# Altium schematic sheet breakout_board.SchDoc
size B
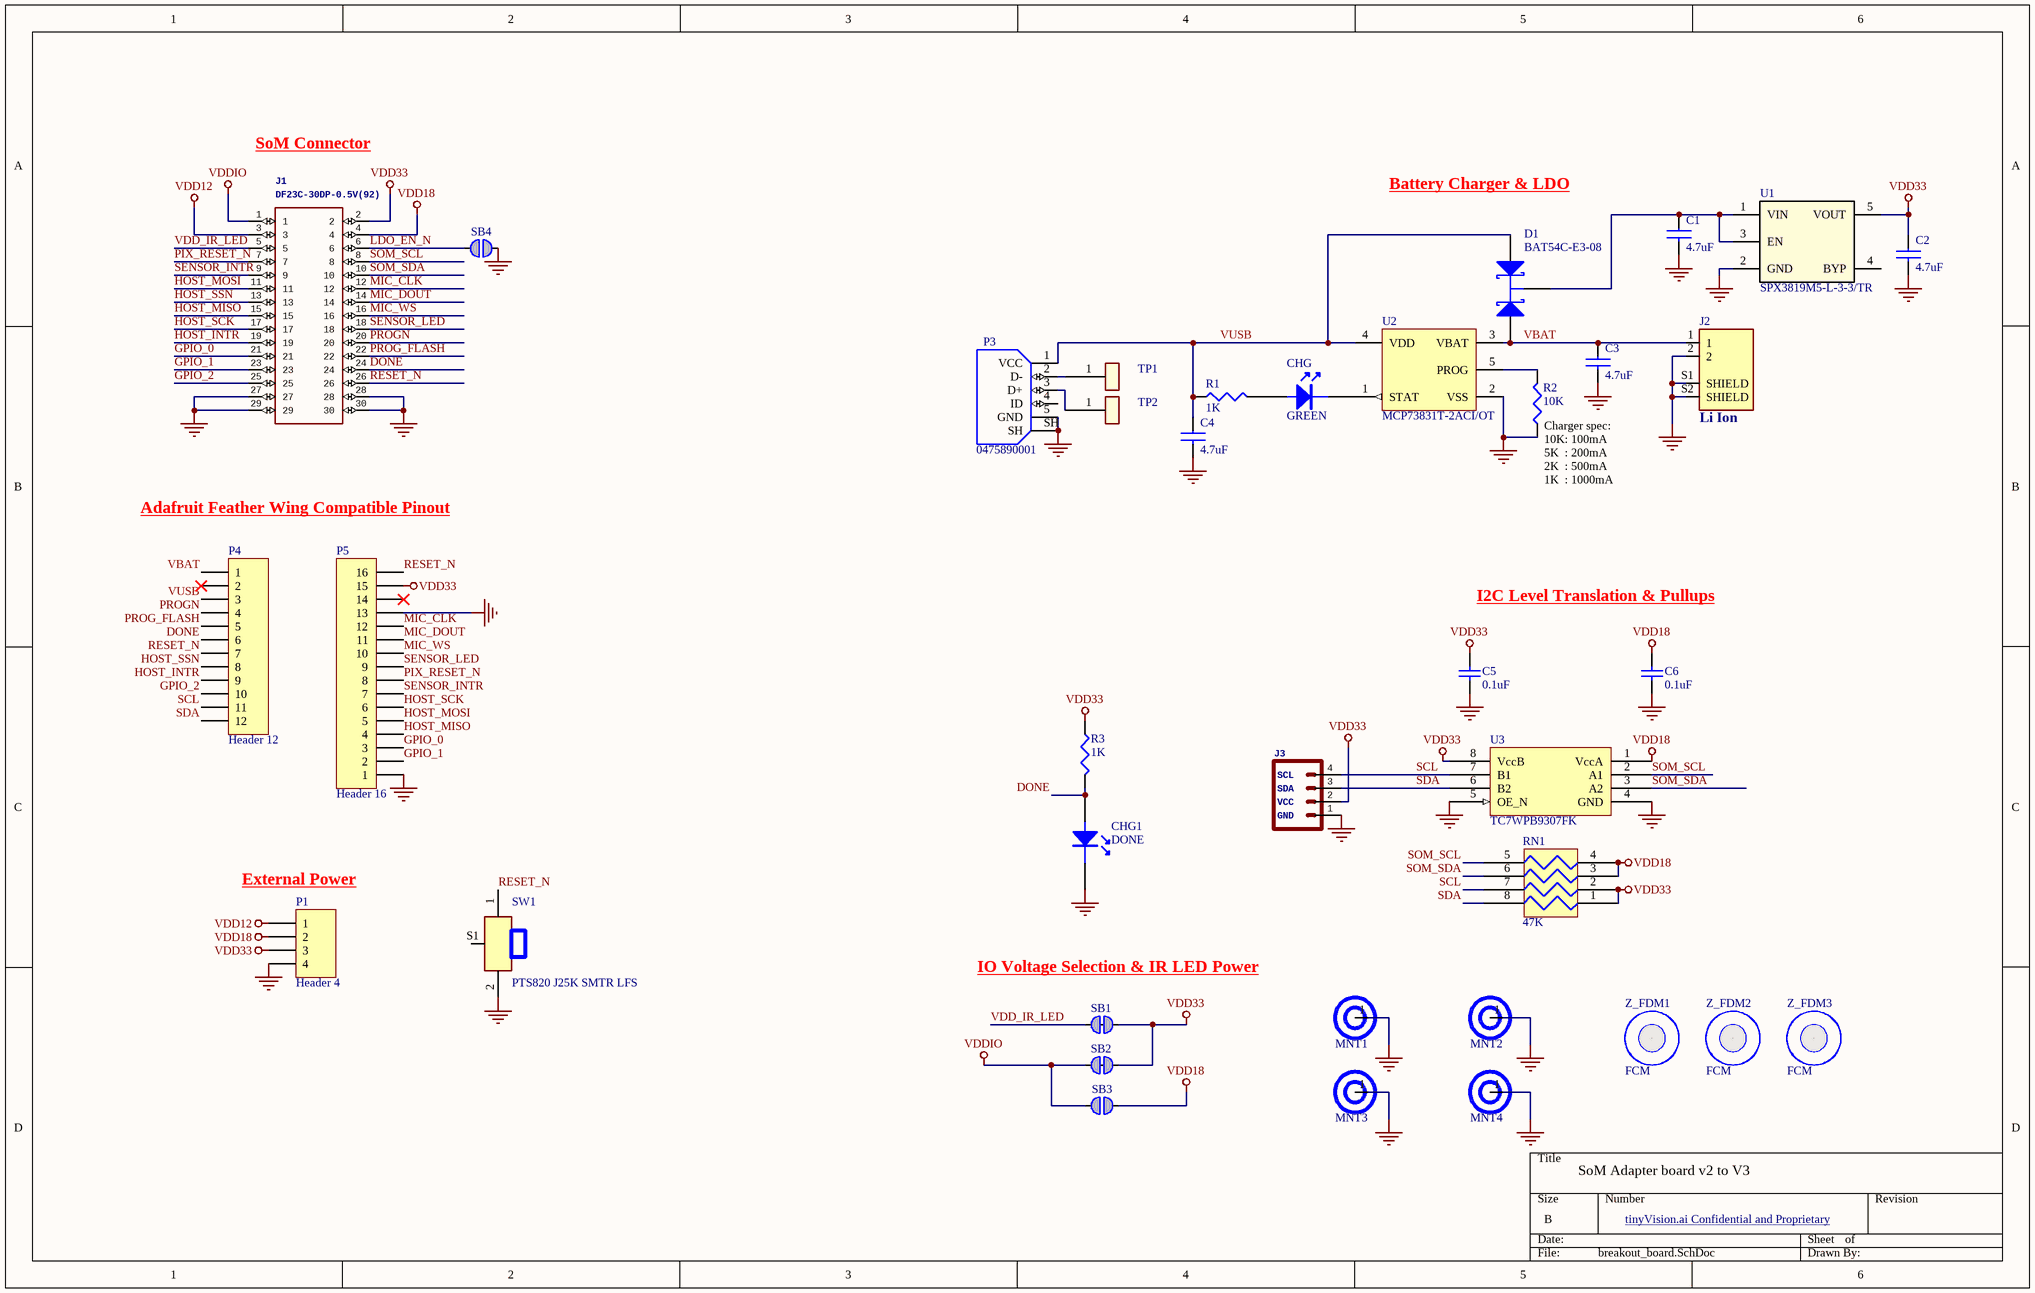
[diagram p0: breakout_board.SchDoc]

## Parts
C1  4.7uF  [CAPC1005X61USR]
C2  4.7uF  [CAPC1005X61USR]
C3  4.7uF  [CAPC1005X61USR]
C4  4.7uF  [CAPC1005X61USR]
C5  0.1uF  [CAPC1005X61USR]
C6  0.1uF  [CAPC1005X61USR]
CHG  GREEN  [LED_0805]
CHG1  DONE  [LED_0805]
D1  BAT54C-E3-08  [SOT-23]
J1  DF23C-30DP-0.5V(92)  [SOM-SMD]
J2  Li Ion  [JST_S2B-PH-SM4-TB(LF)(SN)]
J3  (no value)  [1X04_1MM_RA]
MNT1  MOUNTING HOLE  [MNT620-275N]  (value not drawn)
MNT2  MOUNTING HOLE  [MNT620-275N]  (value not drawn)
MNT3  MOUNTING HOLE  [MNT620-275N]  (value not drawn)
MNT4  MOUNTING HOLE  [MNT620-275N]  (value not drawn)
P1  Header 4  [HDR1X4]
P3  0475890001  [*MOLEX_0475890001]
P4  Header 12  [HDR1X12]
P5  Header 16  [HDR1X16]
R1  1K  [RESC1005X40USR]
R2  10K  [RESC1005X40USR]
R3  1K  [RESC1005X40USR]
RN1  47K  [RESCAXS50P100X200X45-8NA]
SB1  Solderbridge  [Solderbridge_Shorted]  (value not drawn)  (net tie, no BOM)
SB2  Solderbridge  [Solderbridge_Shorted]  (value not drawn)  (net tie, no BOM)
SB3  Solderbridge  [Solderbridge]  (value not drawn)  (no BOM)
SB4  Solderbridge  [Solderbridge]  (value not drawn)  (no BOM)
SW1  PTS820 J25K SMTR LFS  [PTS820J25MSMTRLFS]
TP1  TEST POINT  [TP 1mm]  (value not drawn)
TP2  TEST POINT  [TP 1mm]  (value not drawn)
U1  SPX3819M5-L-3-3/TR  [SOT-23-5]
U2  MCP73831T-2ACI/OT  [SOT-23-5]
U3  TC7WPB9307FK  [8-VFSOP]
Z_FDM1  FCM  [FID100X250N]
Z_FDM2  FCM  [FID100X250N]
Z_FDM3  FCM  [FID100X250N]

## Nets
GND: C1.2 C2.2 C3.2 C4.2 C5.2 C6.2 CHG1.2 J1.27 J1.28 J1.29 J1.30 J2.2 J2.S1(SHIELD) J2.S2(SHIELD) J3.1 MNT1.1(GND) MNT2.1(GND) MNT3.1(GND) MNT4.1(GND) P1.4 P3.5(GND) P3.SH P5.1 P5.13 R2.1 SB4.1 SW1.2 U1.2(GND) U2.2(VSS) U3.4(GND) U3.5(OE_N)
VDD12: J1.3 P1.1
VDD18: C6.1 J1.4 P1.2 RN1.3 RN1.4 SB3.1 U3.1(VccA)
VDD33: C2.1 C5.1 J1.2 J3.2 P1.3 P5.15 R3.1 RN1.1 RN1.2 SB1.1 SB2.1 U1.5(VOUT) U3.8(VccB)
VDDIO: J1.1 SB2.2 SB3.2
DONE: CHG1.1 J1.24 P4.6 R3.2
GPIO_0: J1.21 P5.3
GPIO_1: J1.23 P5.2
GPIO_2: J1.25 P4.10
HOST_INTR: J1.19 P4.9
HOST_MISO: J1.15 P5.4
HOST_MOSI: J1.11 P5.5
HOST_SCK: J1.17 P5.6
HOST_SSN: J1.13 P4.8
LDO_EN_N: J1.6 SB4.2
MIC_CLK: J1.12 P5.12
MIC_DOUT: J1.14 P5.11
MIC_WS: J1.16 P5.10
PIX_RESET_N: J1.7 P5.8
PROG_FLASH: J1.22 P4.5
PROGN: J1.20 P4.4
RESET_N: J1.26 P4.7 P5.16 SW1.1
SCL: J3.4 P4.11 RN1.7 U3.7(B1)
SDA: J3.3 P4.12 RN1.8 U3.6(B2)
SENSOR_INTR: J1.9 P5.7
SENSOR_LED: J1.18 P5.9
SOM_SCL: J1.8 RN1.5 U3.2(A1)
SOM_SDA: J1.10 RN1.6 U3.3(A2)
VBAT: C3.1 D1.1(A) J2.1 P4.1 U2.3(VBAT)
VDD_IR_LED: J1.5 SB1.2
VUSB: C4.1 D1.2(A) P3.1(VCC) P4.3 R1.1 U2.4(VDD)
NetC1_1: C1.1 D1.3(K) U1.1(VIN) U1.3(EN)
NetCHG_1: CHG.1 R1.2
NetCHG_2: CHG.2 U2.1(STAT)
NetP3_2: P3.2(D-) TP1.1
NetP3_3: P3.3(D+) TP2.1
NetR2_2: R2.2 U2.5(PROG)

Not connected (* = marked no-connect by the designer): P3 4(ID); P4 2*; P5 14*; SW1 S1(GND); U1 4(BYP); Z_FDM1 1; Z_FDM2 1; Z_FDM3 1

## Notes on the sheet
- SoM Connector
- Battery Charger & LDO
- Adafruit Feather Wing Compatible Pinout
- (near R2) Charger spec:
  10K: 100mA
  5K  : 200mA
  2K  : 500mA
  1K  : 1000mA
- I2C Level Translation & Pullups
- (near P1) External Power
- (near SB1) IO Voltage Selection & IR LED Power
- SoM Adapter board v2 to V3
- tinyVision.ai Confidential and Proprietary <http://tinyVision.ai Confidential and Proprietary>

## Library data of the parts
C1-C4 = CAP NP: CAP CER 4.7UF 6.3V 0402; MPN: C0402C475M7PACTU; Mfg: KEMET; Supplier PN: 399-5499-1-ND
C5 C6 = Cap_100nF_X7R_10%_0402: CAP CER 0.1UF 6.3V 0402; Manufacturer: TDK; Part #: E-CAP-003; MPN: C0402C104Z4VAC7867; Mfg: KEMET; Supplier PN: 399-1043-1-ND; Package: 0402
CHG CHG1 = LED_1: Avago HSMG-C170; Mfg: Avago Technologies US Inc.; MPN: HSMG-C170; Supplier PN: 516-1434-1-ND
D1 = BAT54C: DIODE ARRAY SCHOTTKY 30V SOT23; Manufacturer: Rectron; Packing: Tape and Reel; IR (uA): 2; VF (mV): 800; Trr (ns): 5; Cd (pF): 10; VR (V): 30; Rth(j-a) (K/W): 500; RoHS: TRUE; ComponentLink2URL: http://www.nxp.com/documents/data_sheet/BAT54_SER.pdf; Manufacturer Part Number: BAT54C-E3-08; ComponentLink2Description: Datasheet; Temperature Range: -55 to 150 degC; PackageReference: SOT23-3; PackageDescription: 3-Pin Plastic Surface-mounted Package, Body 1.3 x 2.9 mm, Pitch 0.95 mm; Mounting Technology: Surface Mount; ComponentLink1URL: http://www.nxp.com/; DatasheetVersion: Rev. 5; ComponentLink1Description: Manufacturer URL; Supplier Part Number 1: BAT54C-E3-08CT-ND; Supplier 1: Digi-Key
J1 = DF23C-30DP-0.5V(92): CONN PLUG 30POS SMD GOLD; Manufacturer: Hirose Electric Co Ltd; Allied_Number: R1050738; Digi-Key Part Number: H11880CT-ND; SymbolName_1: DF23C-30DP-0.5V(92); LibraryName: DF23C-30DP-0.5V(92); DeviceSetName: DF23C-30DP-0.5V(92); Package: DF23C30DP05V92; Manufacturer Part Number: DF23C-30DP-0.5V(92); Mouser_Part_Number: 798-DF23C30DP05V92; Mouser_Price-Stock: https://www.mouser.com/Search/Refine.aspx?Keyword=798-DF23C30DP05V92; RS_Part_Number: 7241056; RS_Price-Stock: https://uk.rs-online.com/web/p/products/7241056; Allied_Price-Stock: https://www.alliedelec.com/hirose-electric-df23c-30dp-0-5v-92-/R1050738/; Height: 1mm
J2 = S2B-PH-SM4-TB(LF)(SN): CONN HEADER SMD R/A 2POS 2MM; Manufacturer: JST Sales; Pitch: 2.00mm; Manufacturer Part Number: S2B-PH-SM4-TB(LF)(SN); Supplier Part Number 1: 455-1749-1-ND; Package: None; Height: 5.51mm
J3 = QWIIC_CONNECTORJS-1MM: CONN HEADER SMD R/A 4POS 1MM; MPN: SM04B-SRSS-TB(LF)(SN); Mfg: JST Sales America Inc.; SDA: SDA; VCC: VCC; GND: GND; SCL: SCL; Supplier PN: 455-1804-1-ND
MNT1-MNT4 = MNT_1: Part #: NA; Notes: PCB; Emcraft #: NA
P1 = Header 4: Header, 4-Pin; LatestRevisionDate: 17-Jul-2002; LatestRevisionNote: Re-released for DXP Platform.; Publisher: Altium Limited
P3 = 0475890001: CONN RCPT MICRO USB AB 5P SMD RA; Mfg: Molex; MPN: 0475890001; Supplier PN: WM17143CT-ND
P4 = Header 12: Header, 12-Pin; LatestRevisionDate: 17-Jul-2002; LatestRevisionNote: Re-released for DXP Platform.; Publisher: Altium Limited
P5 = Header 16: Header, 16-Pin; LatestRevisionDate: 17-Jul-2002; LatestRevisionNote: Re-released for DXP Platform.; Publisher: Altium Limited
R1 R3 = R_SH: RESISTOR 1K OHM 1% 0.0625W 0402; MPN: RC0402FR-071KL; Mfg: Yageo; Supplier PN: 311-1.00KLRCT-ND
R2 = R_SH: RES SMD 10K OHM 1% 1/16W 0402; MPN: RC0402FR-0710KL; Mfg: Yageo; Supplier PN: 311-10.0KLRCT-ND
RN1 = EXB-N8V473JX: RES ARRAY 4 RES 47K OHM 0804; Manufacturer: Panasonic; Supplier Part Number 1: Y10473CT-ND; Manufacturer Part Number: EXB-N8V473JX; Price 100: $0.0363; value: 47K; Package: 0804; Price: $0.11; Height: 0.55mm; Supplier 1: Digi-Key
SB1 SB2 = Solderbridge Shorted: Shorted Solderbridge; Artikkelnr Noca: N.A.; Part Number: Solderbridge Shorted; Manufacturer: *; Manufacturer Part Number: *; Datasheet: *; LatestRevisionDate: 2012-08-07; Pin Count: 2; Publisher: Nordic Semiconductor; Published: 2012-08-07; Value: Solderbridge; Note: *; Supplier: *; Supplier part number: *; 2nd source Supplier: *; 2nd source part number: *; Footprint Doc: Solderbridge_Shorted; Artikkelnr Simpro: N.A.
SB3 SB4 = Solderbridge: Artikkelnr Noca: N.A.; Part Number: Solderbridge; Manufacturer: *; Manufacturer Part Number: *; Datasheet: *; LatestRevisionDate: 2009-12-14; Pin Count: 2; Publisher: Nordic Semiconductor; Published: 2009-12-14; Value: Solderbridge; Note: *; Supplier: *; Supplier part number: *; 2nd source Supplier: *; 2nd source part number: *; Footprint Doc: Solderbridge; Artikkelnr Simpro: N.A.
SW1 = SPST_NO: SWITCH TACTILE SPST-NO 0.05A 12V; Manufacturer: C&K; Supplier Part Number 1: CKN10897CT-ND; Supplier 1: Digi-Key; Manufacturer Part Number: PTS820 J25K SMTR LFS
U1 = SPX3819M5-L-3-3/TR: IC REG LINEAR 3.3V 500MA SOT23-5; Manufacturer: MaxLinear, Inc.; Manufacturer Product Number: SPX3819M5-L-3-3/TR; Digi-Key Part Number: 1016-1873-2-ND
U2 = PM-BM-MCP73831-SOT5: IC CONTROLLR LI-ION 4.2V SOT23-5; Mfg: Microchip Technology; MPN: MCP73831T-2ACI/OT; Supplier PN: MCP73831T-2ACI/OTTR-ND; Code_IPC: SOT23-5
U3 = TC7WPB9307FK: X34 GENERAL-PURPOSE BUS SWITCH L; Manufacturer Product Number: TC7WPB9307FK,LF(CT; Manufacturer: Toshiba Semiconductor and Storage; Digi-Key Part Number: TC7WPB9307FKLF(CTTR-ND